# EAGLE design Analog_Board (EAGLE 6.4)
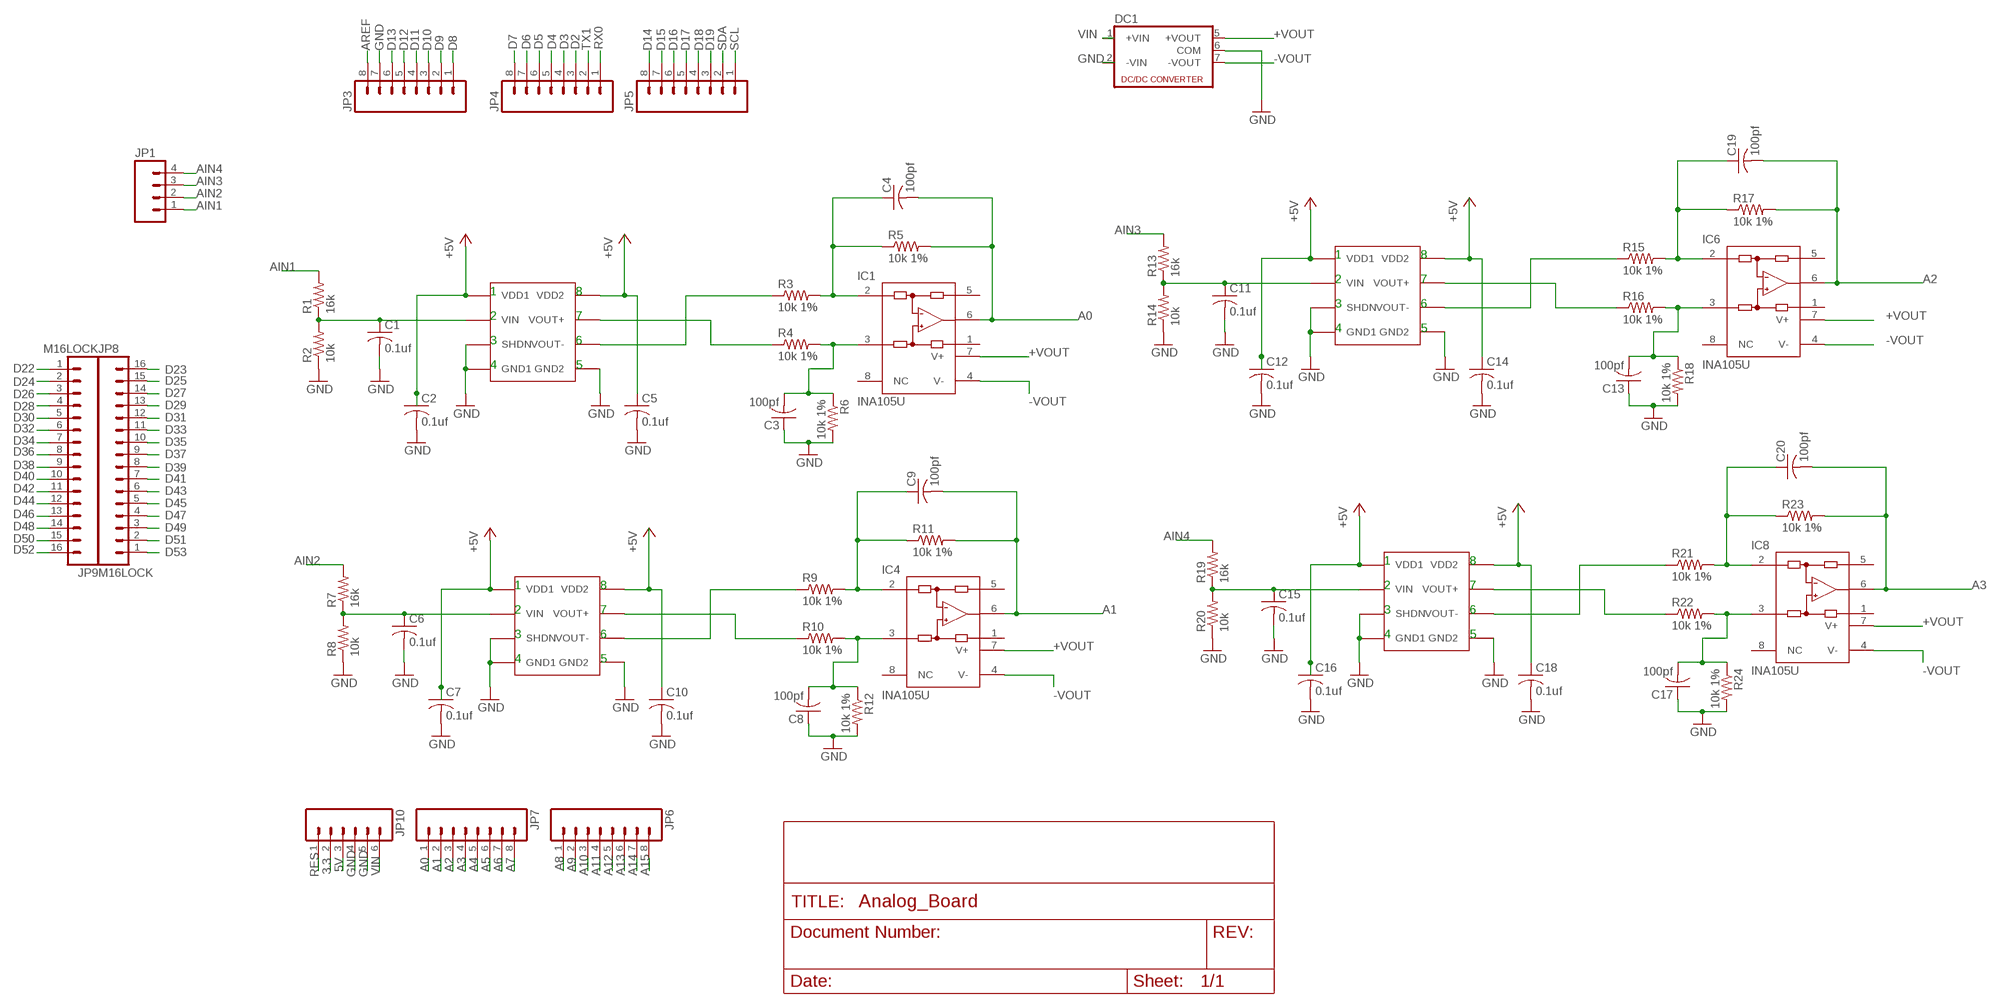
[diagram p0: schematic, sheet 1]

## Parts
C1  0.1uf  C-USC0603  [C0603]
C2  0.1uf  C-USC0603  [C0603]
C3  100pf  C-USC0603  [C0603]
C4  100pf  C-USC0603  [C0603]
C5  0.1uf  C-USC0603  [C0603]
C6  0.1uf  C-USC0603  [C0603]
C7  0.1uf  C-USC0603  [C0603]
C8  100pf  C-USC0603  [C0603]
C9  100pf  C-USC0603  [C0603]
C10  0.1uf  C-USC0603  [C0603]
C11  0.1uf  C-USC0603  [C0603]
C12  0.1uf  C-USC0603  [C0603]
C13  100pf  C-USC0603  [C0603]
C14  0.1uf  C-USC0603  [C0603]
C15  0.1uf  C-USC0603  [C0603]
C16  0.1uf  C-USC0603  [C0603]
C17  100pf  C-USC0603  [C0603]
C18  0.1uf  C-USC0603  [C0603]
C19  100pf  C-USC0603  [C0603]
C20  100pf  C-USC0603  [C0603]
DC1  NMASIP8  [NMA]
IC1  INA105U  [SO08]
IC2  ACPL-C87A-000E  [SO8-WIDE]
IC3  ACPL-C87A-000E  [SO8-WIDE]
IC4  INA105U  [SO08]
IC5  ACPL-C87A-000E  [SO8-WIDE]
IC6  INA105U  [SO08]
IC7  ACPL-C87A-000E  [SO8-WIDE]
IC8  INA105U  [SO08]
JP1  M04LOCK  [1X04_LOCK]
JP3  M08LOCK  [1X08_LOCK]
JP4  M08LOCK  [1X08_LOCK]
JP5  M08LOCK  [1X08_LOCK]
JP6  M08LOCK  [1X08_LOCK]
JP7  M08LOCK  [1X08_LOCK]
JP8  M16LOCK  [1X16_LOCK]
JP9  M16LOCK  [1X16_LOCK]
JP10  M06LOCK  [1X06_LOCK]
R1  16k  R-US_R0603  [R0603]
R2  10k  R-US_R0603  [R0603]
R3  10k 1%  R-US_R0603  [R0603]
R4  10k 1%  R-US_R0603  [R0603]
R5  10k 1%  R-US_R0603  [R0603]
R6  10k 1%  R-US_R0603  [R0603]
R7  16k  R-US_R0603  [R0603]
R8  10k  R-US_R0603  [R0603]
R9  10k 1%  R-US_R0603  [R0603]
R10  10k 1%  R-US_R0603  [R0603]
R11  10k 1%  R-US_R0603  [R0603]
R12  10k 1%  R-US_R0603  [R0603]
R13  16k  R-US_R0603  [R0603]
R14  10k  R-US_R0603  [R0603]
R15  10k 1%  R-US_R0603  [R0603]
R16  10k 1%  R-US_R0603  [R0603]
R17  10k 1%  R-US_R0603  [R0603]
R18  10k 1%  R-US_R0603  [R0603]
R19  16k  R-US_R0603  [R0603]
R20  10k  R-US_R0603  [R0603]
R21  10k 1%  R-US_R0603  [R0603]
R22  10k 1%  R-US_R0603  [R0603]
R23  10k 1%  R-US_R0603  [R0603]
R24  10k 1%  R-US_R0603  [R0603]

## Nets
3.3: JP10.2
5V: JP10.3
+5V: C2.1 C5.1 C7.1 C10.1 C12.1 C14.1 C16.1 C18.1 IC2.1(VDD1) IC2.8(VDD2) IC3.1(VDD1) IC3.8(VDD2) IC5.1(VDD1) IC5.8(VDD2) IC7.1(VDD1) IC7.8(VDD2)
+VOUT: DC1.5(+VOUT) IC1.7(V+) IC4.7(V+) IC6.7(V+) IC8.7(V+)
-VOUT: DC1.7(-VOUT) IC1.4(V-) IC4.4(V-) IC6.4(V-) IC8.4(V-)
A0: C4.2 IC1.6(OUT) JP7.1 R5.2
A1: C9.2 IC4.6(OUT) JP7.2 R11.2
A2: C19.2 IC6.6(OUT) JP7.3 R17.2
A3: C20.2 IC8.6(OUT) JP7.4 R23.2
A4: JP7.5
A5: JP7.6
A6: JP7.7
A7: JP7.8
A8: JP6.1
A9: JP6.2
A10: JP6.3
A11: JP6.4
A12: JP6.5
A13: JP6.6
A14: JP6.7
A15: JP6.8
AIN1: JP1.1 R1.2
AIN2: JP1.2 R7.2
AIN3: JP1.3 R13.2
AIN4: JP1.4 R19.2
AREF: JP3.8
D2: JP4.3
D3: JP4.4
D4: JP4.5
D5: JP4.6
D6: JP4.7
D7: JP4.8
D8: JP3.1
D9: JP3.2
D10: JP3.3
D11: JP3.4
D12: JP3.5
D13: JP3.6
D14: JP5.8
D15: JP5.7
D16: JP5.6
D17: JP5.5
D18: JP5.4
D19: JP5.3
D22: JP9.1
D23: JP8.16
D24: JP9.2
D25: JP8.15
D26: JP9.3
D27: JP8.14
D28: JP9.4
D29: JP8.13
D30: JP9.5
D31: JP8.12
D32: JP9.6
D33: JP8.11
D34: JP9.7
D35: JP8.10
D36: JP9.8
D37: JP8.9
D38: JP9.9
D39: JP8.8
D40: JP9.10
D41: JP8.7
D42: JP9.11
D43: JP8.6
D44: JP9.12
D45: JP8.5
D46: JP9.13
D47: JP8.4
D48: JP9.14
D49: JP8.3
D50: JP9.15
D51: JP8.2
D52: JP9.16
D53: JP8.1
GND: C1.2 C2.2 C3.1 C5.2 C6.2 C7.2 C8.1 C10.2 C11.2 C12.2 C13.1 C14.2 C15.2 C16.2 C17.1 C18.2 DC1.2(-VIN) DC1.6(COM) IC2.3(SHDN) IC2.4(GND1) IC2.5(GND2) IC3.3(SHDN) IC3.4(GND1) IC3.5(GND2) IC5.3(SHDN) IC5.4(GND1) IC5.5(GND2) IC7.3(SHDN) IC7.4(GND1) IC7.5(GND2) JP3.7 JP10.4 JP10.5 R2.1 R6.2 R8.1 R12.2 R14.1 R18.2 R20.1 R24.2
N$2: C20.1 IC8.2(-IN) R21.2 R23.1
N$3: IC2.7(VOUT+) R4.1
N$5: IC2.6(VOUT-) R3.1
N$6: C4.1 IC1.2(-IN) R3.2 R5.1
N$8: C1.1 IC2.2(VIN) R1.1 R2.2
N$9: C3.2 IC1.3(+IN) R4.2 R6.1
N$10: C6.1 IC3.2(VIN) R7.1 R8.2
N$11: IC3.7(VOUT+) R10.1
N$12: IC3.6(VOUT-) R9.1
N$13: C9.1 IC4.2(-IN) R9.2 R11.1
N$14: C8.2 IC4.3(+IN) R10.2 R12.1
N$18: C11.1 IC5.2(VIN) R13.1 R14.2
N$19: IC5.7(VOUT+) R16.1
N$20: IC5.6(VOUT-) R15.1
N$21: C19.1 IC6.2(-IN) R15.2 R17.1
N$22: C13.2 IC6.3(+IN) R16.2 R18.1
N$26: C15.1 IC7.2(VIN) R19.1 R20.2
N$27: IC7.7(VOUT+) R22.1
N$28: IC7.6(VOUT-) R21.1
N$30: C17.2 IC8.3(+IN) R22.2 R24.1
RES: JP10.1
RX0: JP4.1
SCL: JP5.1
SDA: JP5.2
TX1: JP4.2
VIN: DC1.1(+VIN) JP10.6
Unconnected: IC1.1(REF) IC1.5(SENSE) IC1.8(NC) IC4.1(REF) IC4.5(SENSE) IC4.8(NC) IC6.1(REF) IC6.5(SENSE) IC6.8(NC) IC8.1(REF) IC8.5(SENSE) IC8.8(NC)

## Notes on the sheet
- 1 | 8
- 2 | 7
- 1 | 8
- 3 | 6
- 2 | 7
- 4 | 5
- 3 | 6
- 4 | 5
- 1 | 8
- 1 | 8 | 2 | 7
- 2 | 7 | 3 | 6
- 3 | 6 | 4 | 5
- 4 | 5

## Library data of the parts
C1-C20 = rcl:C-US: CAPACITOR, American symbol
DC1 = dc-dc-converter:NMA: DC-DC CONVERTER
IC1 IC4 IC6 IC8 = burr-brown:INA105: Precision Unity Gain Diff. Amplifier; MF: TEXAS INSTRUMENTS; MPN: INA105KU; OC_FARNELL: 1754832; OC_NEWARK: 35C0475
IC2 IC3 IC5 IC7 = ck_custom:ACPL-C87A-000E
JP1 = SparkFun-Connectors:M04: Header 4 Standard 4-pin 0.1" header. Use with straight break away headers (SKU : PRT-00116), right angle break away headers (PRT-00553), swiss pins (PRT-00743), machine pins (PRT-00117), and female headers (PRT-00115). Molex polarized connector foot print use with SKU : PRT-08231 with associated crimp pins and housings. 1MM SMD Version SKU: PRT-10208
JP3-JP7 = SparkFun:M08: Header 8 Standard 8-pin 0.1" header. Use with straight break away headers (SKU : PRT-00116), right angle break away headers (PRT-00553), swiss pins (PRT-00743), machine pins (PRT-00117), and female headers (PRT-00115).
JP8 JP9 = SparkFun:M16
JP10 = SparkFun:M06: Header 6 Standard 6-pin 0.1" header. Use with straight break away headers (SKU : PRT-00116), right angle break away headers (PRT-00553), swiss pins (PRT-00743), machine pins (PRT-00117), and female headers (PRT-00115). Molex polarized connector foot print use with SKU : PRT-08094 with associated crimp pins and housings. NOTES ON THE VARIANTS LOCK and LOCK_LONGPADS... This footprint was designed to help hold the alignment of a through-hole component (i.e. 6-pin header) while soldering it into place. You may notice that each hole has been shifted either up or down by 0.005 of an inch from it's more standard position (which is a perfectly straight line). This slight alteration caused the pins (the squares in the middle) to touch the edges of the holes. Because they are alternating, it causes a "brace" to hold the component in place. 0.005 has proven to be the perfect amount of "off-center" position when using our standard breakaway headers. Although looks a little odd when you look at the bare footprint, once you have a header in there, the alteration is very hard to notice. Also, if you push a header all the way into place, it is covered up entirely on the bottom side. This idea of altering the position of holes to aid alignment will be further integrated into the Sparkfun Library for other footprints. It can help hold any component with 3 or more connection pins.
R1-R24 = adafruit:R-US_: RESISTOR, American symbol

## Board
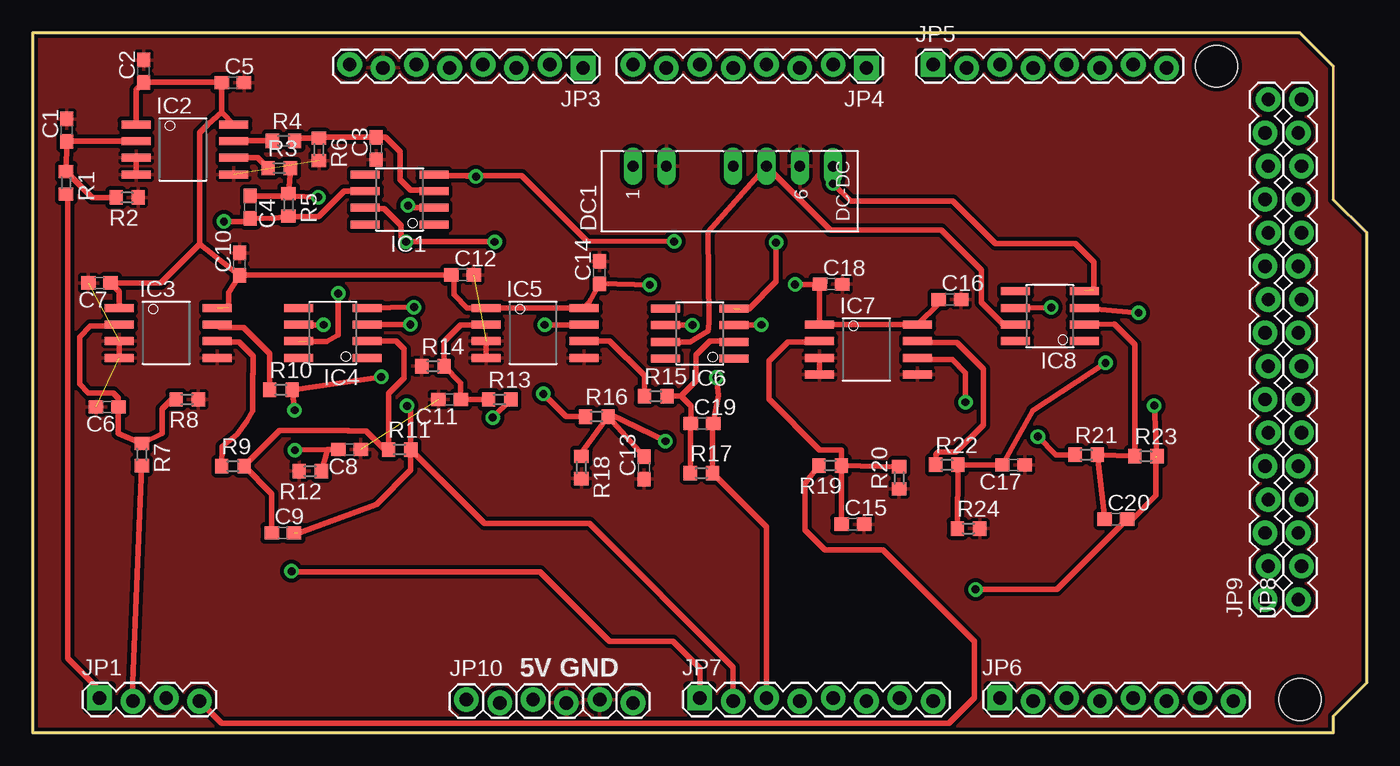
[diagram p1: board, top side]
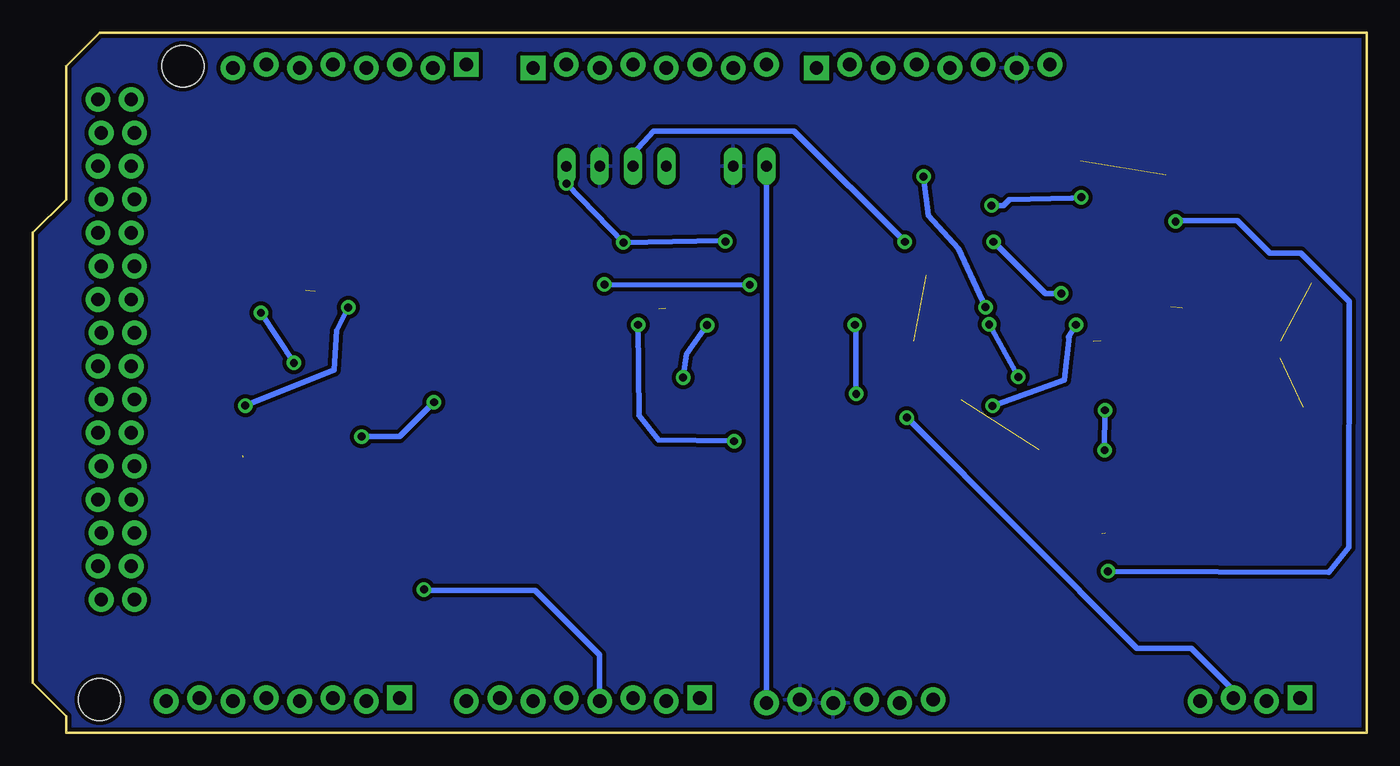
[diagram p2: board, bottom side, seen from below]

Size 101.6 x 53.34 mm. Coordinates in mm from the lower left corner, seen from the top.
Outline: 0,0 99.06,0 99.06,1.27 101.6,3.81 101.6,38.1 99.06,40.64 99.06,50.8 96.52,53.34 0,53.34 0,0
Copper layers (1*16): Top 0.035mm / dielectric 1.5mm / Bottom 0.035mm
Design rules "SparkFun": minimum track width 8mil, minimum drill 20mil, track to track 8mil, track to pad 8mil, pad to pad 8mil, via to via 8mil, smd to smd 8mil, copper to edge 10mil, drill to drill 8mil, minimum pad ring 12mil, minimum via ring 10mil, stop-mask expansion 4mil, vias tented up to drill 25mil, thermal gap 10mil
Holes 3.2 mm at 90.17,50.8 96.52,2.54

### Footprints (pad centres in the part's own frame; a part is rotated, then mirrored left to right if it is on the bottom)
C0603 = smd 1.1 x 1: 1 -0.85,0; 2 0.85,0
NMA = drill 0.813 long: 1 0,6.35; 2 0,3.81; 4 0,-1.27; 5 0,-3.81; 6 0,-6.35 | drill 0.8 long: 7 0,-8.89
SO08 = smd 0.61 x 2.21: 1 -1.905,-2.616; 2 -0.635,-2.616; 3 0.635,-2.616; 4 1.905,-2.616; 5 1.905,2.616; 6 0.635,2.616; 7 -0.635,2.616; 8 -1.905,2.616
SO8-WIDE = smd 0.61 x 2.21: 1 0.635,-1.029; 2 1.905,-1.029; 3 3.175,-1.029; 4 4.445,-1.029; 5 4.445,6.426; 6 3.175,6.426; 7 1.905,6.426; 8 0.635,6.426
1X04_LOCK = drill 1.016 pad 1.88 square: 1 0,0.127 | drill 1.016 pad 1.88: 2 2.54,-0.127; 3 5.08,0.127; 4 7.62,-0.127
1X08_LOCK = drill 1.016 pad 1.88 square: 1 0,0.127 | drill 1.016 pad 1.88: 2 2.54,-0.127; 3 5.08,0.127; 4 7.62,-0.127; 5 10.16,0.127; 6 12.7,-0.127; 7 15.24,0.127; 8 17.78,-0.127
1X16_LOCK = drill 1.016 pad 1.88: 1 0,0.127; 2 2.54,-0.127; 3 5.08,0.127; 4 7.62,-0.127; 5 10.16,0.127; 6 12.7,-0.127; 7 15.24,0.127; 8 17.78,-0.127; 9 20.32,0.127; 10 22.86,-0.127; 11 25.4,0.127; 12 27.94,-0.127; 13 30.48,0.127; 14 33.02,-0.127; 15 35.56,0.127; 16 38.1,-0.127
1X06_LOCK = drill 1.016 pad 1.88: 1 0,0; 2 2.54,-0.254; 3 5.08,0; 4 7.62,-0.254; 5 10.16,0; 6 12.7,-0.254
R0603 = smd 1 x 1.1: 1 -0.85,0; 2 0.85,0

### Placement (x,y rotation side)
C1  2.59,45.92 90 top
C2  8.43,50.42 90 top
C3  26.16,44.53 90 top
C4  16.56,40.06 270 top
C5  15.24,49.53 0 top
C6  5.66,24.84 180 top
C7  5.08,34.29 180 top
C8  24.13,21.59 180 top
C9  19.05,15.24 0 top
C10  15.75,35.71 90 top
C11  31.75,25.4 180 top
C12  32.74,34.9 0 top
C13  46.56,20.19 90 top
C14  43.15,35.08 90 top
C15  62.46,15.9 0 top
C16  69.85,33.02 0 top
C17  74.7,20.42 180 top
C18  60.81,34.19 359.3 top
C19  50.98,23.57 0 top
C20  82.5,16.28 0 top
DC1  52.07,43.18 90 top
IC1  27.94,40.64 90 top
IC2  8.89,46.99 270 top
IC3  7.62,33.02 270 top
IC4  22.86,30.48 90 top
IC5  35.56,33.02 270 top
IC6  50.8,30.43 90 top
IC7  60.96,31.75 270 top
IC8  77.47,31.75 90 top
JP1  5.08,2.54 0 top
JP3  41.91,50.8 180 top
JP4  63.5,50.8 180 top
JP5  68.58,50.8 0 top
JP6  73.66,2.54 0 top
JP7  50.8,2.54 0 top
JP8  96.52,10.16 90 top
JP9  93.98,10.16 90 top
JP10  33.02,2.54 0 top
R1  2.54,41.91 270 top
R2  7.19,40.79 180 top
R3  18.77,43.03 0 top
R4  19.1,45.11 0 top
R5  19.48,40.23 270 top
R6  21.79,44.45 270 top
R7  8.31,21.21 270 top
R8  11.76,25.4 180 top
R9  15.24,20.32 0 top
R10  18.9,26.14 0 top
R11  27.94,21.59 0 top
R12  21.13,19.94 180 top
R13  35.56,25.4 0 top
R14  30.48,27.94 0 top
R15  47.45,25.65 0 top
R16  42.95,24.1 0 top
R17  50.93,19.79 0 top
R18  41.78,20.22 270 top
R19  60.73,20.37 180 top
R20  65.99,19.43 90 top
R21  80.24,21.18 0 top
R22  69.62,20.42 0 top
R23  84.79,21.08 0 top
R24  71.27,15.57 0 top

### Tracks (layer width: path | path; a pad name or v marks a point on that pad's centre or on a via)
3.3
  Top 0.203: JP10.2 35.56,2.54 JP10.2
+5V  (via drill 0.6)  (1 unrouted)
  Top 0.406: C10.1 12.7,37.25 | 12.7,37.25 12.7,45.72 13.34,46.35 14.39,47.28 | 14.39,47.28 C5.1 14.35,49.57 C2.1 7.86,49 IC2.1 | 12.7,37.25 9.74,34.29 C7.1 6.59,33.63 IC3.1 | C10.1 14.91,33.54 14.91,32.44 | C10.1 15.79,34.9 C12.1 32.08,34.71 32.08,33.4 33.1,32.38 IC5.1 IC5.8 42.33,32.73 C14.1 47.15,34.13 v46.99,34.14 | C18.1 59.93,34.17 | 59.93,34.17 IC7.1 IC7.8 69,32.73 C16.1 | 59.93,34.17 59.92,34.16 v58.06,34.16 | IC2.8 14.39,47.28
  Bottom 0.406: v58.06,34.16 v46.99,34.14
+VOUT  (via drill 0.6)  (1 unrouted)
  Top 0.406: IC1.7 25.4,39.93 26.77,39.93 28.04,38.66 28.04,37.8 v28.42,37.41 v35.18,37.41 | v23.27,33.48 23.27,30.33 22.38,29.82 20.83,29.82 | IC6.7 50.06,29.79 51.44,30.61 51.46,30.81 51.51,31.37 51.44,38.15 DC1.5 60.76,38.3 69.22,38.3 72.26,35.26 72.26,32.79 73.94,31.11 IC8.7
  Bottom 0.406: v35.18,37.41 43.61,45.85 54.33,45.85 55.88,44.12 DC1.5 | v28.42,37.41 24.49,33.48 v23.27,33.48
-VOUT  (via drill 0.6)  (2 unrouted)
  Top 0.406: IC4.4 v29.03,32.44 | v33.76,42.39 IC1.4 30.66,42.44 37.24,42.44 42.22,37.47 v48.84,37.44 | v56.62,37.36 56.62,34.39 54.53,32.31 53.9,32.31 | v60.96,41.86 62.31,40.51 70.08,40.51 73.3,37.29 79.4,37.29 80.82,35.87 80.82,33.73
  Bottom 0.406: v29.03,32.44 31.11,36.88 33.38,39.4 v33.76,42.39 | v48.84,37.44 49.15,37.49 v56.62,37.36 v60.96,41.86 DC1.7
A0  (via drill 0.6)
  Top 0.203: JP7.1 50.8,2.54
  Top 0.406: IC1.6 23.72,41.27 21.77,39.32 19.55,39.32 R5.2 18.27,39.17 C4.2 16.32,38.96 v14.55,38.96 | v19.71,12.32 19.76,12.27 38.63,12.27 43.94,6.96 48.77,6.96 50.8,4.93 JP7.1
  Bottom 0.406: v14.55,38.96 14.48,39.04 9.86,39.04 7.37,36.55 5,36.55 1.32,32.87 1.35,14.15 2.9,12.22 v19.71,12.32
A1  (via drill 0.6)  (1 unrouted)
  Top 0.406: R11.2 34.43,15.95 42.39,15.95 53.34,5 JP7.2 | IC4.6 20.27,31.09 v22.15,31.09 | v28.5,24.92 28.79,24.63 R11.2 | 20.18,15.19 26.19,17.42 28.79,20.03 R11.2
  Bottom 0.406: v22.15,31.09 22.71,30.18 22.66,30.28 23.01,26.87 v28.5,24.92
A2  (via drill 0.6)
  Top 0.203: JP7.3 55.88,2.54
  Top 0.406: IC6.6 48.21,31.09 v50.24,31.06 | v52.07,27.08 52.23,25.72 C19.2 51.78,23.52 R17.2 55.88,15.68 JP7.3
  Bottom 0.406: v50.24,31.06 51.82,28.85 v52.07,27.08
A3  (via drill 0.6)  (1 unrouted)
  Top 0.203: JP7.4 58.42,2.54
  Top 0.406: IC8.6 v77.57,32.41 | v71.81,10.92 77.99,10.92 C20.2 83.74,16.28 85.55,18.09 85.55,20.99 | v85.42,24.94 R23.2
  Bottom 0.406: v77.57,32.41 78.46,30.66 78.66,27.64 v85.42,24.94 | v71.81,10.92 71.75,10.87 63.35,10.87 58.42,5.94 JP7.4
A4
  Top 0.203: JP7.5 60.96,2.54
A5
  Top 0.203: JP7.6 63.5,2.54 JP7.6
A6
  Top 0.203: JP7.7 66.04,2.54
A7
  Top 0.203: JP7.8 68.58,2.54 JP7.8
A8
  Top 0.203: JP6.1 73.66,2.54
A9
  Top 0.203: JP6.2 76.2,2.54 JP6.2
A10
  Top 0.203: JP6.3 78.74,2.54
A11
  Top 0.203: JP6.4 81.28,2.54 JP6.4
A12
  Top 0.203: JP6.5 83.82,2.54
A13
  Top 0.203: JP6.6 86.36,2.54 JP6.6
A14
  Top 0.203: JP6.7 88.9,2.54
A15
  Top 0.203: JP6.8 91.44,2.54 JP6.8
AIN1
  Top 0.406: R1.2 2.64,40.96 2.64,5.69 5.08,3.25 JP1.1
AIN2
  Top 0.406: JP1.2 7.56,2.91 R7.2
AIN3  (via drill 0.6)
  Top 0.406: R13.2 35.03,24.02 v35.03,24.03
  Bottom 0.406: v35.03,24.03 17.5,6.43 13.36,6.43 10.16,3.23 JP1.3
AIN4
  Top 0.406: JP1.4 14.38,0.74 69.77,0.74 71.7,2.67 71.7,6.99 64.75,13.95 60.33,13.95 58.8,15.47 58.8,19 58.85,19.05 R19.2
AREF
  Top 0.203: JP3.8 24.13,50.8 JP3.8
D2
  Top 0.203: JP4.3 58.42,50.8
D3
  Top 0.203: JP4.4 55.88,50.8 JP4.4
D4
  Top 0.203: JP4.5 53.34,50.8
D5
  Top 0.203: JP4.6 50.8,50.8 JP4.6
D6
  Top 0.203: JP4.7 48.26,50.8
D7
  Top 0.203: JP4.8 45.72,50.8 JP4.8
D8
  Top 0.203: JP3.1 41.91,50.8
D9
  Top 0.203: JP3.2 39.37,50.8 JP3.2
D10
  Top 0.203: JP3.3 36.83,50.8
D11
  Top 0.203: JP3.4 34.29,50.8 JP3.4
D12
  Top 0.203: JP3.5 31.75,50.8
D14
  Top 0.203: JP5.8 86.36,50.8
D15
  Top 0.203: JP5.7 83.82,50.8 JP5.7
D16
  Top 0.203: JP5.6 81.28,50.8
D17
  Top 0.203: JP5.5 78.74,50.8 JP5.5
D18
  Top 0.203: JP5.4 76.2,50.8
D19
  Top 0.203: JP5.3 73.66,50.8 JP5.3
GND  (5 unrouted)
  Top 0.406: IC3.3 IC3.4 | IC5.3 IC5.4 | IC7.3 IC7.4 | IC2.3 IC2.4
  pour Bottom (isolate 0.305): 0,0 99.06,0 99.06,1.27 101.6,3.81 101.6,38.1 99.06,40.64 99.06,50.8 96.52,53.34 0,53.34 0,2.54
  pour Top (isolate 0.305): 0,0 99.06,0 99.06,1.27 101.6,3.81 101.6,38.1 99.06,40.64 99.06,50.8 96.52,53.34 0,53.34 0,2.54
N$2
  Top 0.406: IC8.2 82.4,31.14 83.94,29.6 R23.1 R21.2 C20.1
N$3
  Top 0.406: IC2.7 15.34,45.11 R4.1
N$5
  Top 0.406: R3.1 17.13,43.81 IC2.6
N$6  (via drill 0.6)
  Top 0.406: 19.67,40.89 R5.1 R3.2 | 19.67,40.89 v21.74,40.82 | v28.57,40.18 28.98,40.01 IC1.2 | 19.67,40.89 C4.1
  Bottom 0.406: v21.74,40.82 22.45,40.74 27.2,40.64 27.69,40.16 v28.57,40.18
N$8
  Top 0.406: IC2.2 arc-90 8.05,45.1 C1.1 R1.1 4.51,40.79 R2.2
N$9
  Top 0.406: R4.2 20.14,45.3 R6.1 21.87,45.38 C3.2 26.86,45.38 27.96,44.27 27.96,42.14 28.04,42.06 28.07,42.06 28.78,41.35 30.48,41.35 IC1.3
N$10
  Top 0.406: R8.2 10.57,25.4 9.86,24.69 9.86,22.8 R7.1 6.51,22.81 C6.1 6.51,25.52 6.12,25.91 4.22,25.91 3.56,26.57 3.56,30.18 4.37,30.99 6.46,30.99 IC3.2
N$11
  Top 0.406: IC3.7 14.28,30.89 16.05,30.89 18.05,28.89 R10.1
N$12
  Top 0.406: IC3.6 14.12,29.77 15.72,29.77 16.79,28.7 16.79,27.36 16.76,27.33 16.76,24.51 16.28,23.72 15.57,22.73 14.41,21.83 R9.1
N$13
  Top 0.406: IC4.2 27.69,29.84 28.3,29.23 28.3,27.05 27.09,25.84 R11.1 26.8,21.59 25.38,23.01 24.03,23.01 24,23.04 18.81,23.04 R9.2 18.2,18.21 C9.1
N$14  (via drill 0.6)
  Top 0.406: R12.1 22.44,21.59 C8.2 v19.96,21.54 | v19.94,24.59 R10.2 v26.54,27.13 | v28.75,31.11 IC4.3
  Bottom 0.406: v19.96,21.54 v19.94,24.59 | v26.54,27.13 v28.75,31.11
N$18
  Top 0.406: IC5.2 34.48,31.06 32.59,31.06 31.33,29.81 R14.2 32.6,26.67 C11.1 R13.1
N$19  (via drill 0.6)
  Top 0.406: IC5.7 41.96,31.09 v38.99,31.09 | v38.89,25.83 40.62,24.11 R16.1
  Bottom 0.406: v38.99,31.09 38.89,30.99 v38.89,25.83
N$20
  Top 0.406: IC5.6 42.01,29.87 43.94,29.87 46.6,27.21 R15.1
N$21
  Top 0.406: IC6.2 53.37,29.84 51.59,29.84 50.52,28.78 50.52,26.8 49.38,25.65 | 49.38,25.65 R15.2 | 49.38,25.65 50.13,24.9 C19.1 50.08,23.52 R17.1
N$22  (via drill 0.6)
  Top 0.406: R16.2 41.85,21.41 R18.1 | R16.2 C13.2 | R16.2 43.99,24.26 v48.18,22.23 | v55.5,31.09 IC6.3
  Bottom 0.406: v48.18,22.23 53.95,22.3 55.42,24.18 v55.5,31.09
N$26
  Top 0.406: IC7.2 59.85,29.77 57.51,29.77 56.06,28.32 56.06,25.43 59.92,21.57 61.54,21.57 61.58,21.53 R19.1 | R20.2 R19.1 | R19.1 C15.1
N$27
  Top 0.406: IC7.7 67.49,29.74 70.38,29.74 72.39,27.74 72.39,23.47 70.31,21.39 68.96,21.39 68.77,21.2 R22.1
N$28  (via drill 0.6)
  Top 0.406: IC7.6 67.51,28.45 70.03,28.45 71.04,27.43 v71.04,25.2 | v76.56,22.58 77.93,21.18 R21.1
  Bottom 0.406: v71.04,25.2 73.66,22.58 v76.56,22.58
N$30  (via drill 0.6)
  Top 0.406: R24.1 R22.2 C17.2 76.17,24.56 v81.71,28.19 | v84.23,32 84.25,31.98 IC8.3
  Bottom 0.406: v81.71,28.19 v84.23,32
RX0
  Top 0.203: JP4.1 63.5,50.8
SCL
  Top 0.203: JP5.1 68.58,50.8 JP5.1
SDA
  Top 0.203: JP5.2 71.12,50.8
TX1
  Top 0.203: JP4.2 60.96,50.8 JP4.2
VIN
  Bottom 0.406: DC1.1 JP10.6

### Text on the board
tPlace: 5V | GND